# EAGLE design giraffe_bosch (EAGLE 7.3.0)
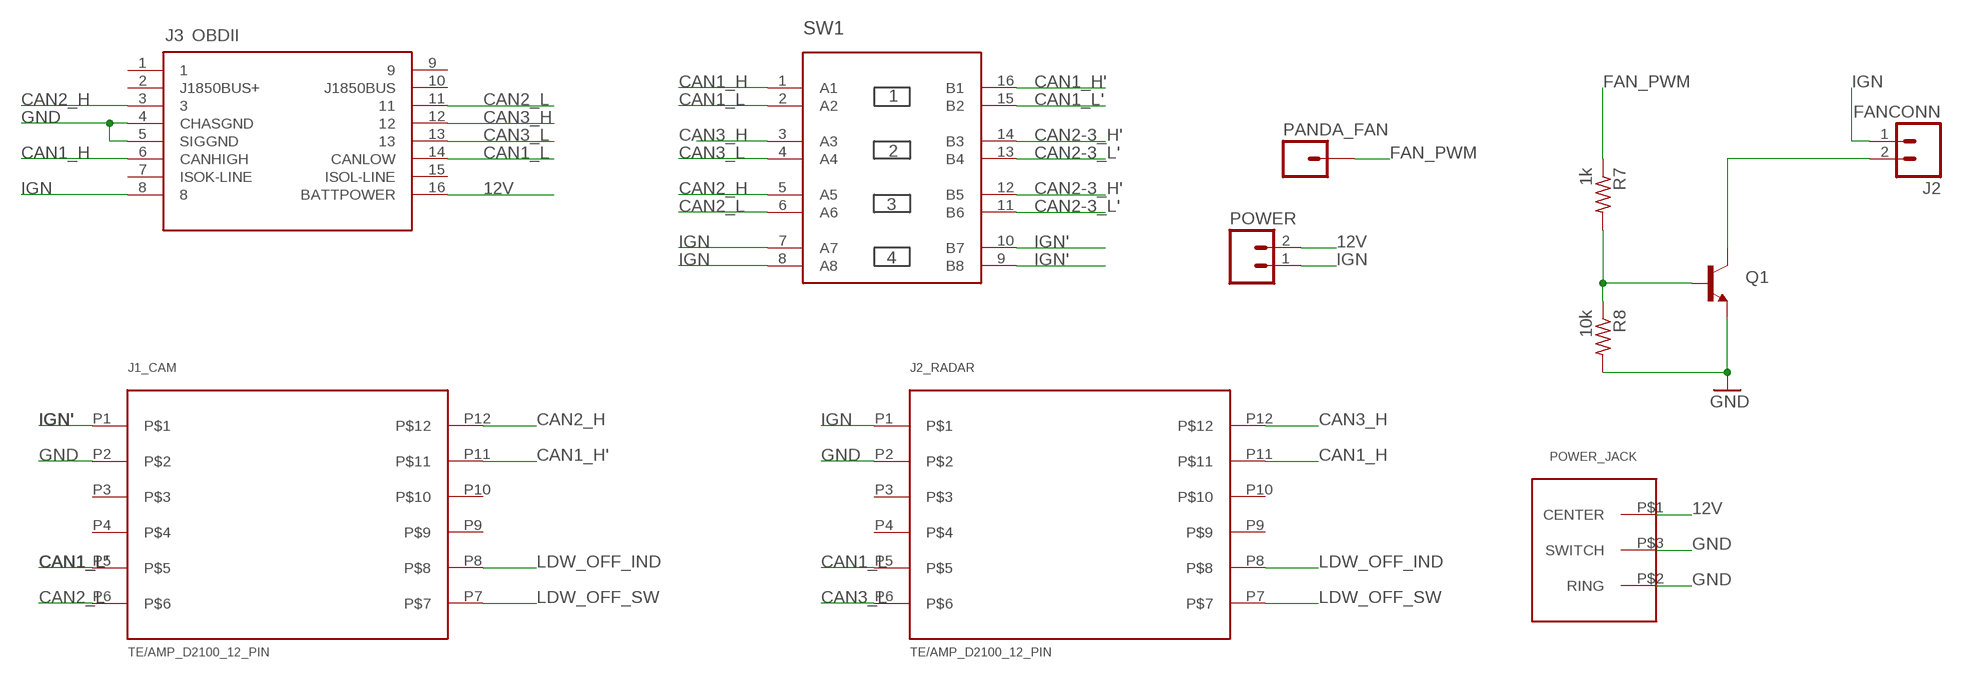
[diagram p0: schematic, sheet 1]

## Parts
J1_CAM  TE/AMP_D2100_12_PIN  [TE/AMP_D2100_12_PIN]
J2  FANCONN  [1.25CONN]
J2_RADAR  TE/AMP_D2100_12_PIN  [TE/AMP_D2100_12_PIN]
J3  OBDIIFEMALE  [OBDII-FEMALE]
PANDA_FAN  M01PTH  [1X01]
POWER  M02PTH  [1X02]
POWER_JACK  PJ-006A-SMT  [PJ-006A-SMT]
Q1  MMBT2222A  TRANSISTOR_NPNMMBT2222A  [SOT23-3]
R7  1k  R-US_R0603  [R0603]
R8  10k  R-US_R0603  [R0603]
SW1  4XDPSTSMT  [4-DPST]

## Nets
12V [PWR]: J3.16(BATTPOWER) POWER.2 POWER_JACK.P$1(CENTER)
CAN1_H: J2_RADAR.P11 J3.6(CANHIGH) SW1.1(A1)
CAN1_H': J1_CAM.P11 SW1.16(B1)
CAN1_L: J2_RADAR.P5 J3.14(CANLOW) SW1.2(A2)
CAN1_L': J1_CAM.P5 SW1.15(B2)
CAN2-3_H': SW1.12(B5) SW1.14(B3)
CAN2-3_L': SW1.11(B6) SW1.13(B4)
CAN2_H: J1_CAM.P12 J3.3 SW1.5(A5)
CAN2_L: J1_CAM.P6 J3.11 SW1.6(A6)
CAN3_H: J2_RADAR.P12 J3.12 SW1.3(A3)
CAN3_L: J2_RADAR.P6 J3.13 SW1.4(A4)
FAN_PWM [PWR]: PANDA_FAN.1 R7.1
GND: J1_CAM.P2 J2_RADAR.P2 J3.4(CHASGND) J3.5(SIGGND) POWER_JACK.P$2(RING) POWER_JACK.P$3(SWITCH) Q1.2(E) R8.2
IGN [PWR]: J2.1 J2_RADAR.P1 J3.8 POWER.1 SW1.7(A7) SW1.8(A8)
IGN' [PWR]: J1_CAM.P1 SW1.9(B8) SW1.10(B7)
LDW_OFF_IND: J1_CAM.P8 J2_RADAR.P8
LDW_OFF_SW: J1_CAM.P7 J2_RADAR.P7
N$6: J2.2 Q1.3(C)
N$7: Q1.1(B) R7.2 R8.1
Unconnected: J1_CAM.P3 J1_CAM.P4 J1_CAM.P9 J1_CAM.P10 J2_RADAR.P3 J2_RADAR.P4 J2_RADAR.P9 J2_RADAR.P10 J3.1 J3.2(J1850BUS+) J3.7(ISOK-LINE) J3.9 J3.10(J1850BUS) J3.15(ISOL-LINE)

## Notes on the sheet
- OBDII

## Library data of the parts
J1_CAM J2_RADAR = Souers:TE/AMP_D2100_12_PIN
J2 = comma.ai:FANCONN
J3 = comma.ai:OBDII: OBDII connector footprint
PANDA_FAN = SparkFun-Connectors:M01: Header 1 Standard 1-pin 0.1" header. Use with straight break away headers (SKU : PRT-00116), right angle break away headers (PRT-00553), swiss pins (PRT-00743), machine pins (PRT-00117), and female headers (PRT-00115). SMTSO-256-ET is a "flush mount" nut for a 4-40 screw. The older package used to be too tight, and did not allow it to sit properly thru the drill hit. The latest (0.165DIA) fits nice and snug.
POWER = SparkFun-Connectors:M02: Standard 2-pin 0.1" header. Use with - straight break away headers ( PRT-00116) - right angle break away headers (PRT-00553) - swiss pins (PRT-00743) - machine pins (PRT-00117) - female headers (PRT-00115) Molex polarized connector foot print use with: PRT-08233 with associated crimp pins and housings. 2.54_SCREWTERM for use with PRT-10571. 3.5mm Screw Terminal footprints for PRT-08084 5mm Screw Terminal footprints for use with PRT-08432
POWER_JACK = Souers:PJ-006A-SMT
Q1 = SparkFun-DiscreteSemi:TRANSISTOR_NPN: Generic NPN BJT MMBT2222A - TRANS-08049 (SOT-23, 1A 40V) MPSA42 - TRANS-09116 (SOT-23, 500mA 300V) MMBT5088LT1G - TRANS-11160 (SOT-23, 50 mA 30V) BC547 - COM-08928 <http://www.sparkfun.com/products/8928> (TO-92 45V 100mA) (1.Collector 2.Base 3.Emitter) 2N3904 - COM-00521 <http://www.sparkfun.com/products/521> (TO-92 40V 200mA) (1.Emitter 2.Base 3.Collector) P2N2222A - COM-12852 <http://www.sparkfun.com/products/12852> (TO-92 40V 600mA) (1.Collector 2.Base 3.Emitter); PROD_ID: TRANS-08049
R7 R8 = adafruit:R-US_: RESISTOR, American symbol
SW1 = comma.ai:4XDPST

## Net classes
1 PWR: width 1.27 mm, clearance 0.381 mm

## Board
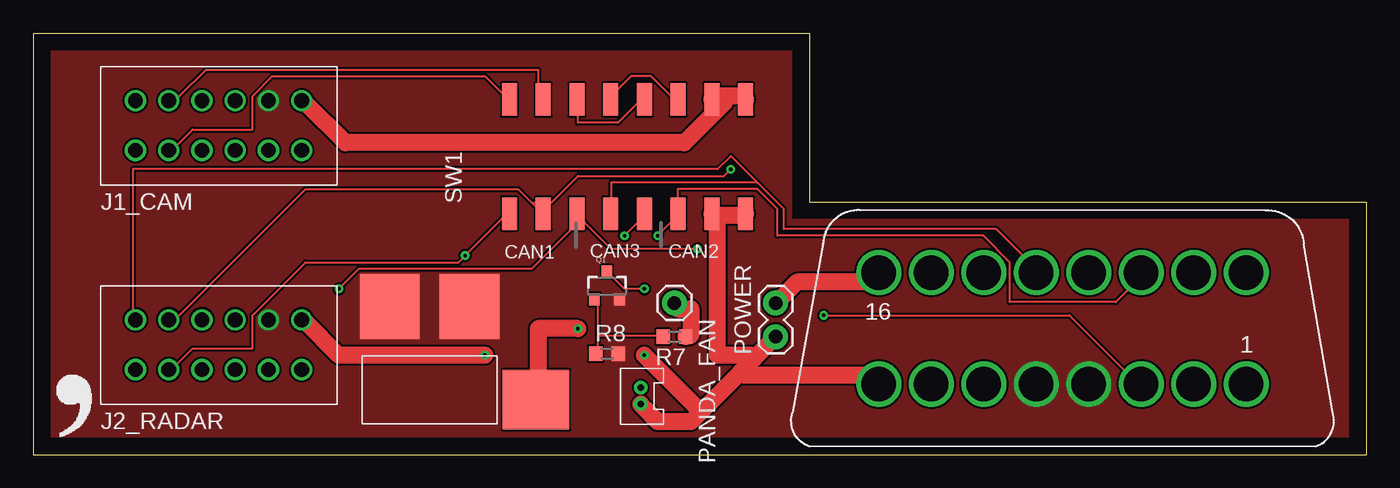
[diagram p1: board, top side]
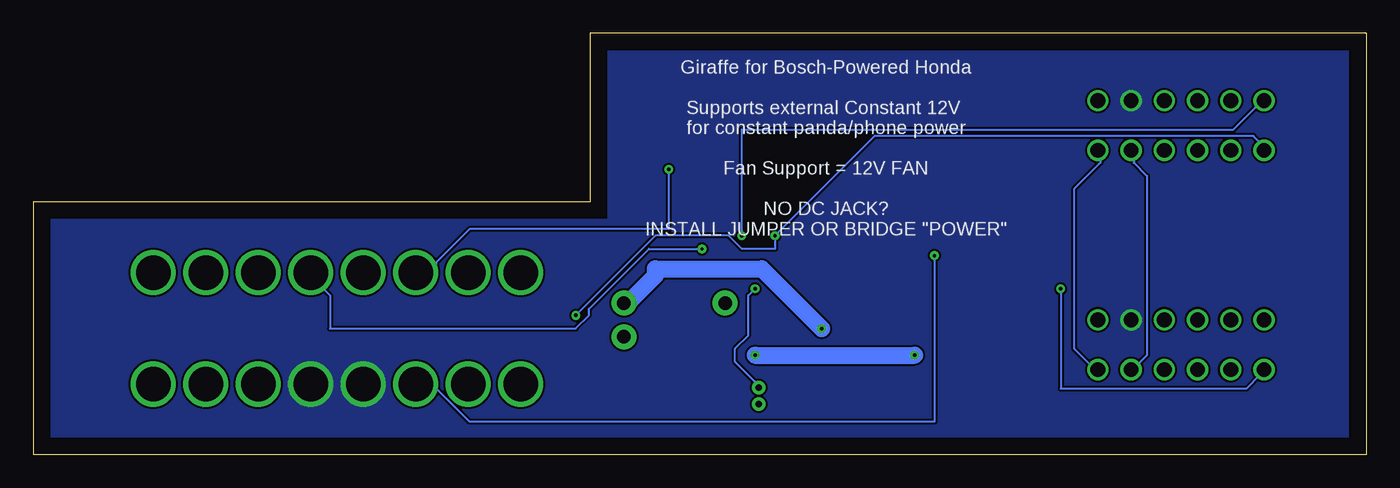
[diagram p2: board, bottom side, seen from below]

Size 100.33 x 31.75 mm. Coordinates in mm from the lower left corner, seen from the top.
Outline: 0,31.75 58.42,31.75 58.42,19.05 100.33,19.05 100.33,0 0,0 0,31.75
Copper layers (1*16): Top 0.035mm / dielectric 1.5mm / Bottom 0.035mm
Design rules "default *": minimum track width 6mil, minimum drill 10mil, track to track 6mil, track to pad 6mil, pad to pad 6mil, via to via 6mil, smd to smd 6mil, copper to edge 10mil, drill to drill 10mil, minimum pad ring 10mil, minimum via ring 8mil, stop-mask expansion 4mil, vias tented up to drill 0mil, thermal gap 10mil
tKeepout: area -1.3,30.5 to 59.7,31.8; area -1.3,-1.3 to 0,30.5; area -1.3,-1.3 to 100.3,1.3; area 99.1,-1.3 to 101.6,20.3; area 57.1,17.8 to 101.6,31.8
bKeepout: area -1.3,30.5 to 59.7,31.8; area -1.3,-1.3 to 0,30.5; area -1.3,-1.3 to 101.6,1.3; area 99.1,-1.3 to 101.6,20.3; area 57.2,17.8 to 101.6,20.3; area 57.2,17.8 to 59.7,31.8; area 0,30.5 to 59.7,31.8
tRestrict: area 0,0 to 100.3,1.3; area 99.1,0 to 100.3,19.1; area 57.1,17.8 to 100.3,19; area 57.1,17.8 to 58.4,31.8; area 0,30.5 to 58.4,31.8; area 0,0 to 1.3,31.8
bRestrict: area 46,0.2 to 46.8,0.6; area 0,30.5 to 58.4,31.8; area 57.1,17.8 to 58.4,31.8; area 57.1,17.8 to 100.3,19; area 99.1,0 to 100.3,19.1; area 0,0 to 100.3,1.3; area 0,0 to 1.3,31.8
vRestrict: area 0,30.5 to 58.4,31.8; area 57.1,17.8 to 58.4,31.8; area 57.1,17.8 to 100.3,19; area 99.1,0 to 100.3,19.1; area 0,0 to 100.3,1.3; area 0,0 to 1.3,31.8

### Footprints (pad centres in the part's own frame; a part is rotated, then mirrored left to right if it is on the bottom)
TE/AMP_D2100_12_PIN = drill 1.1: P1 7.5,0; P2 5,0; P3 2.5,0; P4 0,0; P5 -2.5,0; P6 -5,0; P7 7.5,-3.75; P8 5,-3.75; P9 2.5,-3.75; P10 0,-3.75; P11 -2.5,-3.75; P12 -5,-3.75
1.25CONN = drill 0.5: 1 0,0; 2 1.25,0
OBDII-FEMALE = drill 2.6 pad 3.4: 1 13.825,-4.2; 2 9.875,-4.2; 3 5.925,-4.2; 4 1.975,-4.2; 5 -1.975,-4.2; 6 -5.925,-4.2; 7 -9.875,-4.2; 8 -13.825,-4.2; 9 13.825,4.2; 10 9.875,4.2; 11 5.925,4.2; 12 1.975,4.2; 13 -1.975,4.2; 14 -5.925,4.2; 15 -9.875,4.2; 16 -13.825,4.2
1X01 = drill 1.016 pad 1.88: 1 0,0
1X02 = drill 1.016 pad 1.88: 1 0,0; 2 2.54,0
PJ-006A-SMT = smd 5 x 4.5: P$1 -8,2 | smd 4.5 x 4.9: P$2 -3,-5; P$3 3,-5
SOT23-3 = smd 0.8 x 0.9: 1 -0.95,-1; 2 0.95,-1; 3 0,1.1
R0603 = smd 1 x 1.1: 1 -0.85,0; 2 0.85,0
4-DPST = smd 1.13 x 2.44: 1 -8.89,-4.3; 2 -6.35,-4.3; 3 -3.81,-4.3; 4 -1.27,-4.3; 5 1.27,-4.3; 6 3.81,-4.3; 7 6.35,-4.3; 8 8.89,-4.3; 9 8.89,4.3; 10 6.35,4.3; 11 3.81,4.3; 12 1.27,4.3; 13 -1.27,4.3; 14 -3.81,4.3; 15 -6.35,4.3; 16 -8.89,4.3

### Placement (x,y rotation side)
J1_CAM  12.7,26.67 0 top
J2  45.72,3.81 90 top
J2_RADAR  12.7,10.16 0 top
J3  77.47,9.53 0 top
PANDA_FAN  48.26,11.43 270 top
POWER  55.88,8.89 90 top
POWER_JACK  29.84,6.16 180 top
Q1  43.18,12.7 0 top
R7  48.26,8.89 180 top
R8  43.18,7.62 0 top
SW1  44.73,22.45 0 top
U$1  [LOGO]  1.12,1.04 0 top

### Tracks (layer width: path | path; a pad name or v marks a point on that pad's centre or on a via)
12V  (via drill 0.25)
  Top 1.27: POWER.2 56,11.5 57.5,13 63,13 63.5,13.5 J3.16 | v41,9.5 38,9.5 38,4.5 POWER_JACK.P$1
  Bottom 1.27: v41,9.5 45.5,14 53.5,14 53.5,13.5 55.5,11.5 POWER.2
CAN1_H  (via drill 0.25)
  Top 0.152: SW1.1 35.5,18 v32.5,15 32,14.5 20.5,14.5 16.5,10.5 16.5,8 12,8 10.5,6.5 J2_RADAR.P11
  Bottom 0.152: v32.5,15 32.5,2.5 67.5,2.5 70,5 71.5,5 J3.6
CAN1_H'
  Top 0.152: SW1.16 35.5,27 34,28.5 18,28.5 16.5,27 16.5,24.5 12,24.5 10.5,23 J1_CAM.P11
CAN1_L  (via drill 0.25)
  Top 0.152: 37.5,19 36.5,20 20.5,20 11,10.5 10.5,10.5 J2_RADAR.P5 | 37.5,19 38,18.5 SW1.2 | v52.5,21.5 52,21 41,21 39,19 37.5,19
  Bottom 0.152: v52.5,21.5 52.5,17 67.5,17 70,14.5 70,14 71.5,14 J3.14
CAN1_L'
  Top 0.152: SW1.15 38,27 38,29 13,29 11,27 10.5,27 J1_CAM.P5
CAN2-3_H'
  Top 0.152: SW1.14 41,26.5 41,25 44,25 45.5,26.5 46,26.5 SW1.12
CAN2-3_L'
  Top 0.152: SW1.13 43.5,27 45,28.5 46.5,28.5 48,27 48.5,27 SW1.11
CAN2_H  (via drill 0.25)
  Top 0.152: v44.5,16.5 46,18 SW1.5 | v59.5,10.5 78,10.5 83,5.5 J3.3
  Bottom 0.152: J1_CAM.P12 8,23 8,23.5 8.5,24 37,24 v44.5,16.5 44.5,15.5 47,15.5 48,16.5 53.5,16.5 v59.5,10.5
CAN2_L  (via drill 0.25)
  Top 0.152: J3.11 83.5,13.5 81.5,11.5 73.5,11.5 73.5,14.5 71.5,16.5 56,16.5 56,18.5 54.5,20 48.5,20 48.5,18.5 SW1.6 48.5,18 v47,16.5
  Bottom 0.152: v47,16.5 47,24.5 10,24.5 8,26.5 J1_CAM.P6
CAN3_H  (via drill 0.25)
  Top 0.152: 41.5,17.5 43.5,15.5 v50,15.5 | 41.5,17.5 41,18 SW1.3 | v23,12.5 24.5,14 37.5,14 41,17.5 41.5,17.5
  Bottom 0.152: v50,15.5 54,15.5 58.5,11 58.5,10.5 59.5,9.5 78,9.5 78,12 79,13 79,13.5 J3.12 | v23,12.5 23,5 9,5 8,6 J2_RADAR.P12
CAN3_L
  Top 0.152: 54.5,20.5 43.5,20.5 43.5,18.5 SW1.4 | 54.5,20.5 56.5,18.5 56.5,17 72.5,17 75.5,14 J3.13 | 54.5,20.5 52.5,22.5 51.5,21.5 7.5,21.5 7.5,10.5 J2_RADAR.P6
FAN_PWM
  Top 1.27: R7.1 49.5,9 49.5,11 48.5,11 PANDA_FAN.1
GND
  pour Bottom (no thermals): 0,31.75 58.42,31.75 58.42,19.05 100.33,19.05 100.33,0 0,0
  pour Top (no thermals): 0,31.75 58.42,31.75 58.42,19.05 100.33,19.05 100.33,0 0,0
IGN  (via drill 0.25)
  Top 1.27: SW1.8 53.5,18 51.5,18 SW1.7 51.5,17.5 51.5,7.5 54,7.5 54.25,7.25 | 54.25,7.25 55.5,8.5 POWER.1 | 54.25,7.25 53.25,6.25 | 53.25,6.25 50.25,3.25 | 50.25,3.25 49.5,2.5 47,2.5 46,3.5 J2.1 | v34,7.5 23,7.5 20.5,10 J2_RADAR.P1 | 50.25,3.25 v46,7.5 | J3.8 63.5,5.5 63,6 53.5,6 53.25,6.25
  Bottom 1.27: v46,7.5 v34,7.5
IGN'
  Top 1.27: 52,27 53.5,27 SW1.9 | 52,27 51.5,27 SW1.10 | J1_CAM.P1 20.5,26.5 23.5,23.5 49,23.5 52,26.5 52,27
LDW_OFF_IND
  Bottom 0.152: J2_RADAR.P8 17.5,6.5 16.5,7.5 16.5,21 17.5,22 17.5,22.5 J1_CAM.P8
LDW_OFF_SW
  Bottom 0.152: J2_RADAR.P7 20.5,6.5 22,8 22,20 20,22 20,22.5 J1_CAM.P7
N$6  (via drill 0.25)
  Top 0.152: v46,12.5 44.5,12.5 43.5,13.5 Q1.3
  Bottom 0.152: v46,12.5 46.5,12 46.5,9 47.5,8 47.5,7 46,5.5 46,5 J2.2
N$7
  Top 0.152: 42.5,9 42.5,8 R8.1 | 42.5,9 42.5,11.5 Q1.1 | 42.5,9 47,9 R7.2

### Text on the board
tPlace: CAN1 | CAN3 | CAN2
bPlace: Giraffe for Bosch-Powered Honda / / Supports external Constant 12V / for constant panda/phone power / / Fan Support = 12V FAN / / NO DC JACK? / INSTALL JUMPER OR BRIDGE "POWER"
Document: *compatible with freeTheC pins soldered on TOP